# Altium schematic sheet USBToSerial.SchDoc
size A4
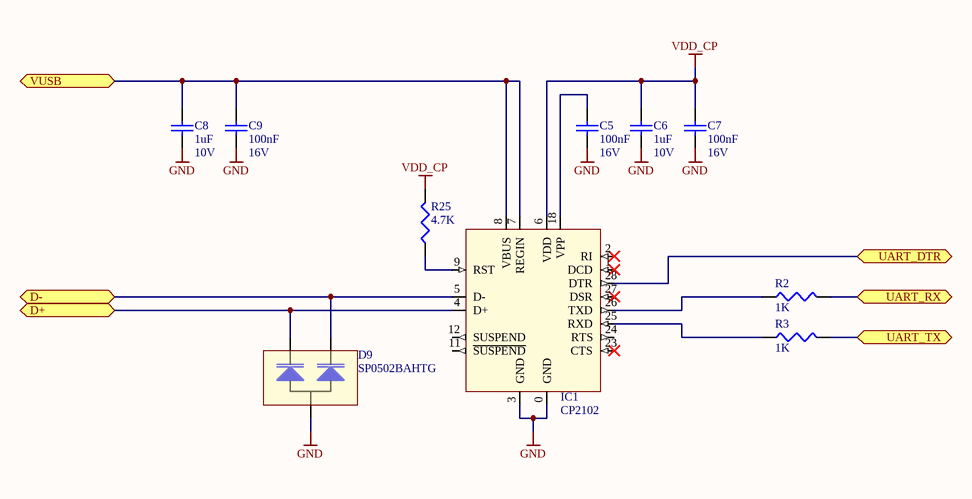
[diagram p0: USBToSerial.SchDoc]

## Parts
C5  100nF  Voltage Rating: 16V  [C0603]
C6  1uF  Voltage Rating: 10V  [C0603]
C7  100nF  Voltage Rating: 16V  [C0603]
C8  1uF  Voltage Rating: 10V  [C0603]
C9  100nF  Voltage Rating: 16V  [C0603]
D9  SP0502BAHTG  [SOT23]
IC1  CP2102  [QFN28]
R2  1K  [0603]
R3  1K  [0603]
R25  4.7K  [0603]

## Ports
D+, D-, UART_DTR, UART_RX, UART_TX, VUSB

## Nets
GND: C5.1 C6.1 C7.1 C8.1 C9.1 D9.A IC1.0(GND) IC1.3(GND)
VDD_CP: C6.2 C7.2 IC1.6(VDD) R25.2
D+: D9.K2 IC1.4(D+) ; port D+
D-: D9.K1 IC1.5(D-) ; port D-
UART_DTR: IC1.28(DTR) ; port UART_DTR
UART_RX: R2.2 ; port UART_RX
UART_TX: R3.2 ; port UART_TX
VUSB: C8.2 C9.2 IC1.7(REGIN) IC1.8(VBUS) ; port VUSB
NetC5_2: C5.2 IC1.18(VPP)
NetIC1_9: IC1.9(RST) R25.1
NetIC1_25: IC1.25(RXD) R3.1
NetIC1_26: IC1.26(TXD) R2.1

Not connected (* = marked no-connect by the designer): IC1 1(DCD)* 2(RI)* 11(~{SUSPEND}) 12(SUSPEND) 23(CTS)* 24(RTS) 27(DSR)*

## Library data of the parts
C5 C7 C9 = 100nF/0603/CER/16V: Capacitor, 100nF, 16V, X7R; Capacitance Tolerance: ± 10%; Capacitor Case Style: 0603; Brand Number: MC0603B104K160CT; Brand: MULTICOMP; Dielectric Characteristic: X7R; Capacitance: 100nF; Temperature Range: -55°C to +125°C; Price: 0,01; Order Code Supplier: 1759016; Supplier: Farnell
C6 C8 = 1uF/0603/CER/10V/X5R: Capacitor, 1uF, 10V, X5R; Capacitance Tolerance: ± 10%; Brand Number: C1608X5R1A105K080AC; Brand: TDK; Dielectric Characteristic: X5R; Capacitance: 1uF; Capacitor Case Style: C0603; Temperature Range: -55°C to +85°C; Price: 0,0083; Order Code Supplier: 2346890; Supplier: Farnell
D9 = SP0502BAHTG: Diode TVS Dual, Vrwm: 5.5V Vc: 8V; Brand: LITTLEFUSE; Case Style: SOT-23; Brand Number: SP0502BAHTG; Clamping Voltage: 8V; Order Code Supplier: 1827631; Price: 0,80; Supplier: Farnell; Temperature Range: -40°C to +125°C; Vrwm: 5.5V
IC1 = CP2102: USB to UART converter; Brand Number: CP2102-GM; Case Style: QFN28; Price: 3,73; Order Code Supplier: 9282130; Supplier 1: Farnell
R2 R3 = 1K/0603/0063W/50V: Resistor, 1K, 1%, 0.063W, 50V, 100PPM, 0603; Brand: VISHAY DRALORIC; Brand Number: CRCW06031K00FKEA; Case Style: 0603; Order Code Supplier: 2122366; Power Rating: 0.063W; Price: 0,039; Resistance: 1K; Supplier: Farnell; Temperature Coefficient: ± 100PPM; Temperature Range: -55°C to +125°C; Voltage Rating: 50V
R25 = 4.7K/0603/0063W/50V: Resistor, 4.7K, 1%, 0.063W, 60V, 100PPM, 0603; Brand: VISHAY DRALORIC; Brand Number: CRCW06034K70FKEA; Case Style: 0603; Order Code Supplier: 2122450; Power Rating: 0.063W; Price: 0,038; Resistance: 4.7K; Supplier: Farnell; Temperature Coefficient: ± 100PPM; Temperature Range: -55°C to +125°C; Voltage Rating: 60V